# Altium schematic sheet DropCounter.SchDoc
size A
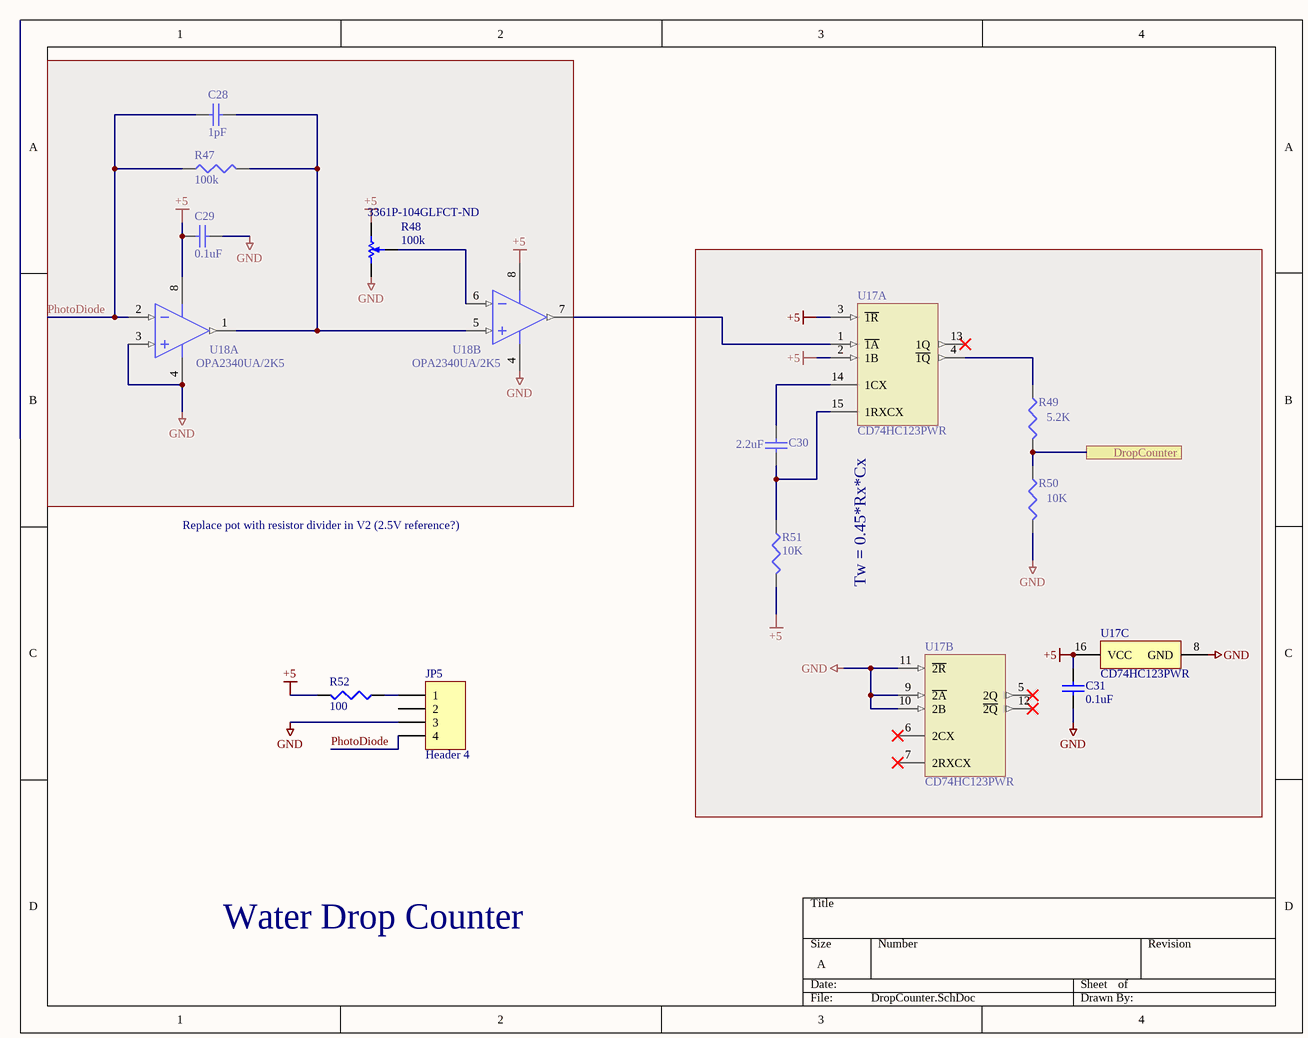
[diagram p0: DropCounter.SchDoc]

## Parts
C28  value 1pF  [J1-0603]  (hidden comment: Cap Semi)
C29  value 0.1uF  [J1-0603]  (hidden comment: Cap Semi)
C30  value 2.2uF  [J1-0603]  (hidden comment: Cap Semi)
C31  value 0.1uF  [J1-0603]  (hidden comment: Cap Semi)
JP5  Header 4  [HDR1X4]
R47  value 100k  [J1-0603]  (hidden comment: Res3)
R48  100k  Supplier Part Number 1: 3361P-104GLFCT-ND  [TrimPot]
R49  value 5.2K  [J1-0603]  (hidden comment: Res3)
R50  10K  [J1-0603]
R51  10K  [J1-0603]
R52  value 100  [J1-0603]  (hidden comment: Res3)
U17  CD74HC123PWR  [PW0016A_M]  (parts A,B,C of 3)
U18  OPA2340UA/2K5  [D0008A_L]  (parts A,B of 2)

## Blocks framed on the sheet
Tw = 0.45*Rx*Cx: C30 C31 R49-R51 U17

## Ports
DropCounter

## Nets
+5: C29.1 C31.1 R48.1 R51.2 R52.2 U17.2(1B) U17.3(~{1R}) U17.16(VCC) U18.8(V+)
GND: C29.2 C31.2 JP5.3 R48.3 R50.2 U17.8(GND) U17.9(~{2A}) U17.10(2B) U17.11(~{2R}) U18.3(IN_A+) U18.4(V-)
DropCounter: R49.2 R50.1 ; port DropCounter
PhotoDiode: C28.1 JP5.4 R47.1 U18.2(IN_A-)
NetC28_2: C28.2 R47.2 U18.1(OUT_A) U18.5(IN_B+)
NetC30_1: C30.1 R51.1 U17.15(1RXCX)
NetC30_2: C30.2 U17.14(1CX)
NetJP5_1: JP5.1 R52.1
NetR48_2: R48.2 U18.6(IN_B-)
NetR49_1: R49.1 U17.4(~{1Q})
NetU17_1: U17.1(~{1A}) U18.7(OUT_B)

Not connected (* = marked no-connect by the designer): JP5 2; U17 5(2Q)* 6(2CX)* 7(2RXCX)* 12(~{2Q})* 13(1Q)*

## Notes on the sheet
- Replace pot with resistor divider in V2 (2.5V reference?)
- Water Drop Counter

## Library data of the parts
C28 = Cap Semi: Capacitor (Semiconductor SIM Model); PartNumber: CC0603CRNPO9BN1R0; Manufacturer: Yageo; Description: CAP CER 1PF 50V C0G/NPO 0603; Published: 8-Jun-2000; LatestRevisionDate: 29-May-2009; LatestRevisionNote: IPC-7351 Footprint Added.; PackageReference: C1206; Publisher: Altium Limited; PackageDescription: Chip Capacitor; Supplier 1: Digi-Key; Supplier Part Number 1: 311-1049-1-ND
C29 C31 = Cap Semi: Capacitor (Semiconductor SIM Model); PartNumber: CL10F104ZO8NNNC; Manufacturer: Samsung; Description: CAP CER 0.1UF 16V Y5V 0603; Published: 8-Jun-2000; LatestRevisionDate: 29-May-2009; LatestRevisionNote: IPC-7351 Footprint Added.; PackageReference: C1206; Publisher: Altium Limited; PackageDescription: Chip Capacitor; Descriptoin: *
C30 = Cap Semi: Capacitor (Semiconductor SIM Model); PartNumber: C0603C225K4PACTU; Manufacturer: KEMET; Description: CAP CER 2.2UF 16V X5R 0603; Published: 8-Jun-2000; LatestRevisionDate: 29-May-2009; LatestRevisionNote: IPC-7351 Footprint Added.; PackageReference: C1206; Publisher: Altium Limited; PackageDescription: Chip Capacitor
JP5 = Header 4: Header, 4-Pin; PartNumber: 0022053041; Manufacturer: Molex; Description: CONN HEADER R/A 4POS 2.54MM; LatestRevisionDate: 17-Jul-2002; LatestRevisionNote: Re-released for DXP Platform.; Publisher: Altium Limited
R47 = Res3: Resistor; PartNumber: RR0816P-104-D; Manufacturer: Susumu; Description: RES SMD 100K OHM 0.5% 1/16W 0603; Published: 8-Jun-2000; LatestRevisionDate: 29-May-2009; LatestRevisionNote: IPC-7351 Footprint Added.; PackageReference: J1-0603; Publisher: Altium Limited; PackageDescription: Chip Resistor; Supplier 1: Digi-Key; Supplier Part Number 1: RR08P100KDCT-ND
R48 = RPot SM: Square Trimming Potentiometer; PartNumber: 3361P-1-104GLF; Manufacturer: Bourns Inc.; Description: TRIMMER 100K OHM 0.5W GW TOP ADJ; Published: 17-Dec-2003; DatasheetVersion: Oct-2003; PackageReference: POT4MM-2; Publisher: Altium Limited; PackageDescription: Square Trimming Potentiometer; ComponentLink1Description: Manufacturer Link; ComponentLink1URL: http://bourns.com/2/search.html; Supplier 1: Digi-Key
R49 = Res3: Resistor; PartNumber: RMCF0603FT5K23; Manufacturer: Stackpole Electronics; Description: RES 5.23K OHM 1% 1/10W 0603; Published: 8-Jun-2000; LatestRevisionDate: 29-May-2009; LatestRevisionNote: IPC-7351 Footprint Added.; PackageReference: J1-0603; Publisher: Altium Limited; PackageDescription: Chip Resistor; Supplier 1: Digi-Key; Supplier Part Number 1: RMCF0603FT5K23CT-ND
R50 R51 = Res3: Resistor; PartNumber: RC0603JR-0710KL; Manufacturer: Yageo; Description: RES SMD 10K OHM 5% 1/10W 0603; Published: 8-Jun-2000; LatestRevisionDate: 29-May-2009; LatestRevisionNote: IPC-7351 Footprint Added.; PackageReference: J1-0603; Publisher: Altium Limited; PackageDescription: Chip Resistor; Value: 10K
R52 = Res3: Resistor; PartNumber: RC0603FR-07100RL; Manufacturer: Yageo; Description: RES SMD 100 OHM 1% 1/10W 0603; Published: 8-Jun-2000; LatestRevisionDate: 29-May-2009; LatestRevisionNote: IPC-7351 Footprint Added.; PackageReference: J1-0603; Publisher: Altium Limited; PackageDescription: Chip Resistor; Supplier 1: Digi-Key; Supplier Part Number 1: 311-100HRCT-ND
U17 = CMP-1629-00133-2: High Speed CMOS Logic Dual Retriggerable Monostable Multivibrators with Reset, PW0016A, LARGE T&R; Manufacturer: Texas Instruments; F @ Nom Voltage(Max)(Mhz): 70; Bits(#): 2; Rating: Catalog; Technology Family: HC; Output Drive (IOL/IOH)(Max)(mA): 5.2/-5.2; Schmitt Trigger: No; Input Type: LVTTL/CMOS; tpd @ Nom Voltage(Max)(ns): 68; ICC @ Nom Voltage(Max)(mA): 0.08; Voltage(Nom)(V): 3.3,5; VCC(Max)(V): 6; Description: IC DUAL RETRIG MULTIVIB 16-TSSOP; Output Type: CMOS; DatasheetVersion: SCHS142F; Generic Part Number: CD74HC123; Operating Temperature Range(C): -55 to 125; Code_JEDEC: MO-153; VCC(Min)(V): 2; PackageReference: PW0016A; PartNumber: CD74HC123PWR; Supplier 1: Digi-Key; Supplier Part Number 1: 296-12780-1-ND
U18 = CMP-0272-00789-3: Single-Supply, Rail-to-Rail Operational Amplifier MicroAmplifier(TM) Series, 2.5 to 5.5 V, -40 to 85 degC, 8-pin SOIC (D8), Green (RoHS & no Sb/Br); Manufacturer: Texas Instruments; Sub Family: Low Input Bias Current Amp (<=10pA), Low Offset Voltage Amplifier (<=500uV), Low Supply Voltage Amplifier (<=2.7V), Precision Amplifier; Offset Drift(Typ)(uV/C): 2.5; CMRR(Min)(dB): 80; Vn at 1kHz(Typ)(nV/rtHz): 25; Vio (25C)(Max)(mV): 0.5; Number of Channels: 2; Iq per channel(Max)(mA): 0.95; Slew Rate(Typ)(V/us): 6; Total Supply Voltage(Max)(+5V is 5, +/-5V is 10): 5.5; IIB(Max)(pA): 10; Description: IC OPAMP GP 2 CIRCUIT 8SOIC; Eco-Plan: Green (RoHS & no Sb/Br); ComponentLink3URL: http://www.ti.com/litv/pdf/msoi002j; PartNumber: OPA2340UA/2K5; PackageReference: D0008A; ComponentLink2URL: http://www.ti.com/general/docs/lit/getliterature.tsp?genericPartNumber=OPA2340&fileType=pdf; Code_JEDEC: MS-012; DatasheetVersion: SBOS073B; ComponentLink1URL: http://www.ti.com/; ComponentLink3Description: Package Specification; ComponentLink2Description: Datasheet; PackageVersion: 4040047-3/M, 06/2011; Mounting Technology: Surface Mount; PackageDescription: 8-Pin Plastic Small Outline, Body 4.9 x 3.9 mm, Pitch 1.27 mm; Total Supply Voltage(Min)(+5V is 5, +/-5V is 10): 2.5; ComponentLink1Description: Manufacturer URL